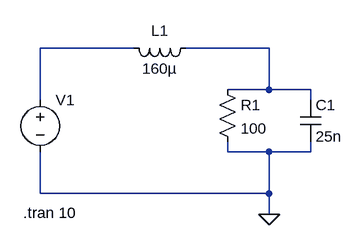
[diagram p0: schematic LTSpice_PR_13.asc]
LTSpice_PR_13.asc, the LTspice schematic file:
Version 4
SHEET 1 880 680
WIRE 192 96 48 96
WIRE 400 96 272 96
WIRE 400 160 400 96
WIRE 400 160 336 160
WIRE 464 160 400 160
WIRE 48 176 48 96
WIRE 464 176 464 160
WIRE 336 256 336 240
WIRE 400 256 336 256
WIRE 464 256 464 240
WIRE 464 256 400 256
WIRE 48 320 48 256
WIRE 400 320 400 256
WIRE 400 320 48 320
WIRE 400 352 400 320
FLAG 400 352 0
SYMBOL voltage 48 160 R0
WINDOW 3 24 96 Invisible 2
WINDOW 123 0 0 Left 0
WINDOW 39 0 0 Left 0
SYMATTR InstName V1
SYMATTR Value SINE(0 100 1)
SYMBOL ind 288 80 R90
WINDOW 0 5 56 VBottom 2
WINDOW 3 32 56 VTop 2
SYMATTR InstName L1
SYMATTR Value 160µ
SYMATTR SpiceLine Rser=1f
SYMBOL cap 448 176 R0
SYMATTR InstName C1
SYMATTR Value 25n
SYMBOL res 320 144 R0
SYMATTR InstName R1
SYMATTR Value 100
TEXT 22 350 Left 2 !.tran 10

The netlist it stands for:
* LTSpice_PR_13.asc
V1 N001 0 SINE(0 100 1)
L1 N002 N001 160µ Rser=1f
C1 N002 0 25n
R1 N002 0 100
.tran 10
.backanno
.end